# Altium schematic sheet TP4056.SchDoc
size 292 x 193 mm; Author: Power Lin; SheetNumber: 1; SheetTotal: 1; Website: wiki-power.com
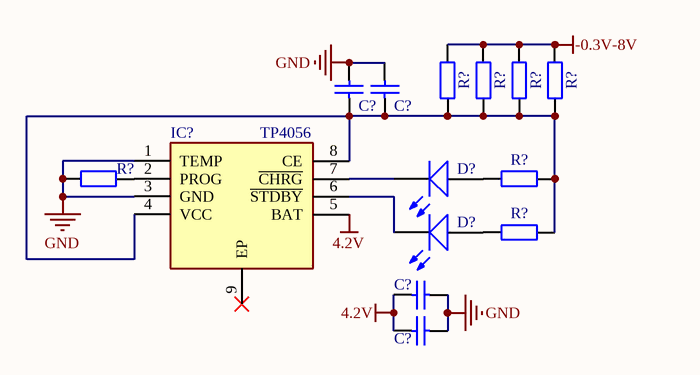
[diagram p0: TP4056.SchDoc]

## Parts
(Parts that share a designator on the sheet are numbered #1, #2 ... from top to bottom, then left to right.)
C?#1  10nF  [CAP-0603]  (value not drawn)
C?#2  100nF  [CAP-0603]  (value not drawn)
C?#3  100nF  [CAP-0603]  (value not drawn)
C?#4  10nF  [CAP-0603]  (value not drawn)
D?#1  红色  [LED-0603]  (value not drawn)
D?#2  绿色  [LED-0603]  (value not drawn)
IC?  TP4056  [MSOP_E120_P0.5_10]
R?#1  1R  [R-0603]  (value not drawn)
R?#2  1R  [R-0603]  (value not drawn)
R?#3  1R  [R-0603]  (value not drawn)
R?#4  1R  [R-0603]  (value not drawn)
R?#5  1.2K  [R-0603]  (value not drawn)
R?#6  2K  [R-0603]  (value not drawn)
R?#7  10K  [R-0603]  (value not drawn)

## Nets
4.2V: C?#3.2 C?#4.2 IC?.5(BAT)
-0.3V-8V: R?#1.2 R?#2.2 R?#3.2 R?#4.2
GND: C?#1.2 C?#2.2 C?#3.1 C?#4.1 IC?.1(TEMP) IC?.3(GND) R?#5.1
NetC?#1_1: C?#1.1 C?#2.1 IC?.4(VCC) IC?.8(CE) R?#1.1 R?#2.1 R?#3.1 R?#4.1 R?#6.2 R?#7.2
NetD?#1_A: D?#1.A R?#6.1
NetD?#1_K: D?#1.K IC?.7(~{CHRG})
NetD?#2_A: D?#2.A R?#7.1
NetD?#2_K: D?#2.K IC?.6(~{STDBY})
NetIC?_2: IC?.2(PROG) R?#5.2

Not connected (* = marked no-connect by the designer): IC? 9(EP)*

## Notes on the sheet
- Author
- DocumentName
- ModifiedDate
- ProjectName
- SheetNumber
- SheetTotal
- Website
- Revision

## Library data of the parts
C?#1-C?#4 = CAP: 贴片电容; ComponentLink1Description: 供应商链接; ComponentLink1URL: http://www.szlcsc.com/product/details_53938.html; Package: 0402; Supplier: LC; SuppliersPartNumber: C52923
D?#1 D?#2 = LED: 发光二极管; ComponentLink1Description: 供应商链接; ComponentLink1URL: http://www.szlcsc.com/product/details_2663.html; Package: 0603; Supplier: LC; SuppliersPartNumber: C2290
IC? = TP4056: 锂电池充电（1A 线性）; Manufacturer_Name: Nanjing Extension Microelectronics; Manufacturer_Part_Number: TP4056-42-ESOP8; Datasheet Link: https://datasheet.lcsc.com/szlcsc/1906261508_Nanjing-Extension-Microelectronics-TP4056-42-ESOP8_C16581.pdf; Height: 1.75mm
R?#1-R?#7 = RES: 贴片电阻; Package: 0805; Supplier: LC; SuppliersPartNumber: C17798